# EAGLE design Grove - Differential Amplifier v1.1 (EAGLE 6.4)
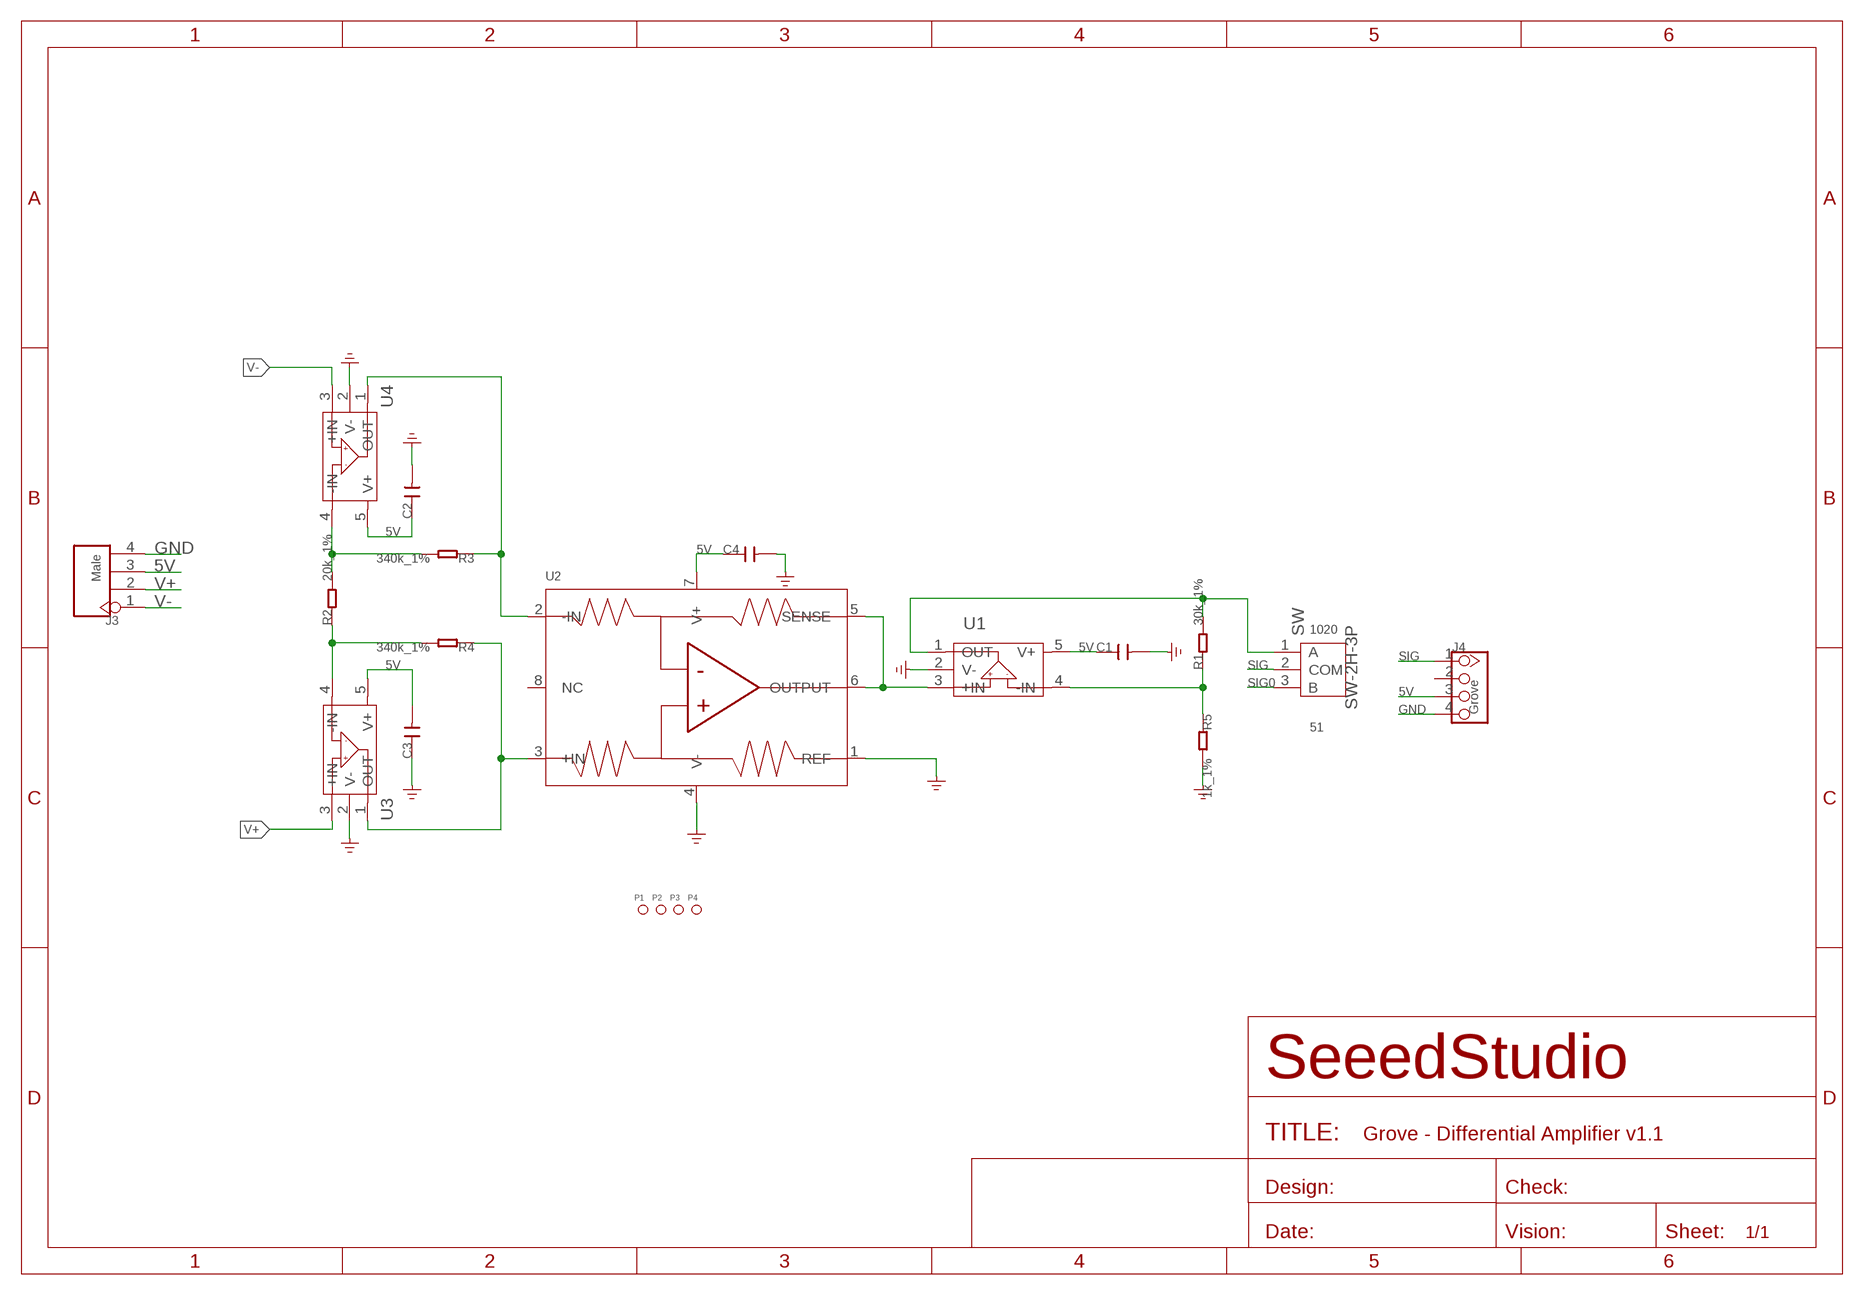
[diagram p0: schematic, sheet 1]

## Parts
C1  C-0603  [C0603]
C2  C-0603  [C0603]
C3  C-0603  [C0603]
C4  C-0603  [C0603]
J3  Male  HEADER-4P-60/35MIL  [4P-65/35MIL]
J4  Grove  TWIG-4P-2.0-2.0  [4P-2.0]
P1  PAD-MARK  [ROUND-MARK-1.0]
P2  PAD-MARK  [ROUND-MARK-1.0]
P3  PAD-MARK  [ROUND-MARK-1.0]
P4  PAD-MARK  [ROUND-MARK-1.0]
R1  30k_1%  R-0603  [R0603]
R2  20k_1%  R-0603  [R0603]
R3  340k_1%  R-0603  [R0603]
R4  340k_1%  R-0603  [R0603]
R5  1k_1%  R-0603  [R0603]
SW  SW-2H-3P  SWITCH-2H-3P'--'  [3P-2CH-3.54X8.5]
U1  OPA333DBV  [SOT23-5]
U2  INA132U/2K5  [SOIC8-6.0]
U3  OPA333DBV  [SOT23-5]
U4  OPA333DBV  [SOT23-5]

## Nets
5V: C1.1 C2.1 C3.2 C4.1 J3.3 J4.3 U1.5(V+) U2.7(V+) U3.5(V+) U4.5(V+)
GND: C1.2 C2.2 C3.1 C4.2 J3.4 J4.4 R5.2 U1.2(V-) U2.1(REF) U2.4(V-) U3.2(V-) U4.2(V-)
N$1: R1.1 R5.1 U1.4(-IN)
N$2: R1.2 SW.1(A) U1.1(OUT)
N$7: R2.1 R4.2 U3.4(-IN)
N$8: R2.2 R3.2 U4.4(-IN)
N$9: R3.1 U2.2(-IN) U4.1(OUT)
N$10: R4.1 U2.3(+IN) U3.1(OUT)
SIG: J4.1 SW.2(COM)
SIG0: SW.3(B) U1.3(+IN) U2.5(SENSE) U2.6(OUTPUT)
V+: J3.2 U3.3(+IN)
V-: J3.1 U4.3(+IN)
Unconnected: J4.2 U2.8(NC)

## Notes on the sheet
- 1020
- 51

## Library data of the parts
C1-C4 = Discrete:C*: Ceramic Capacitors
J3 = Connector:HEADER-4P
J4 = Connector:TWIG-4P-2.0
P1-P4 = Discrete:PAD-MARK; PARTNO: DNP
R1-R5 = Discrete:R*
SW = Discrete:SWITCH-2H-3P
U1 U3 U4 = IC:OPA333: 1.8V,Micro power CMOS oprational amplifiers Zero-Drift Series http://www.ti.com.cn/cn/lit/ds/symlink/opa333.pdf
U2 = template:INA132U/2K5: Low Power, Single-Supply DIFFERENCE AMPLIFIER

## Board
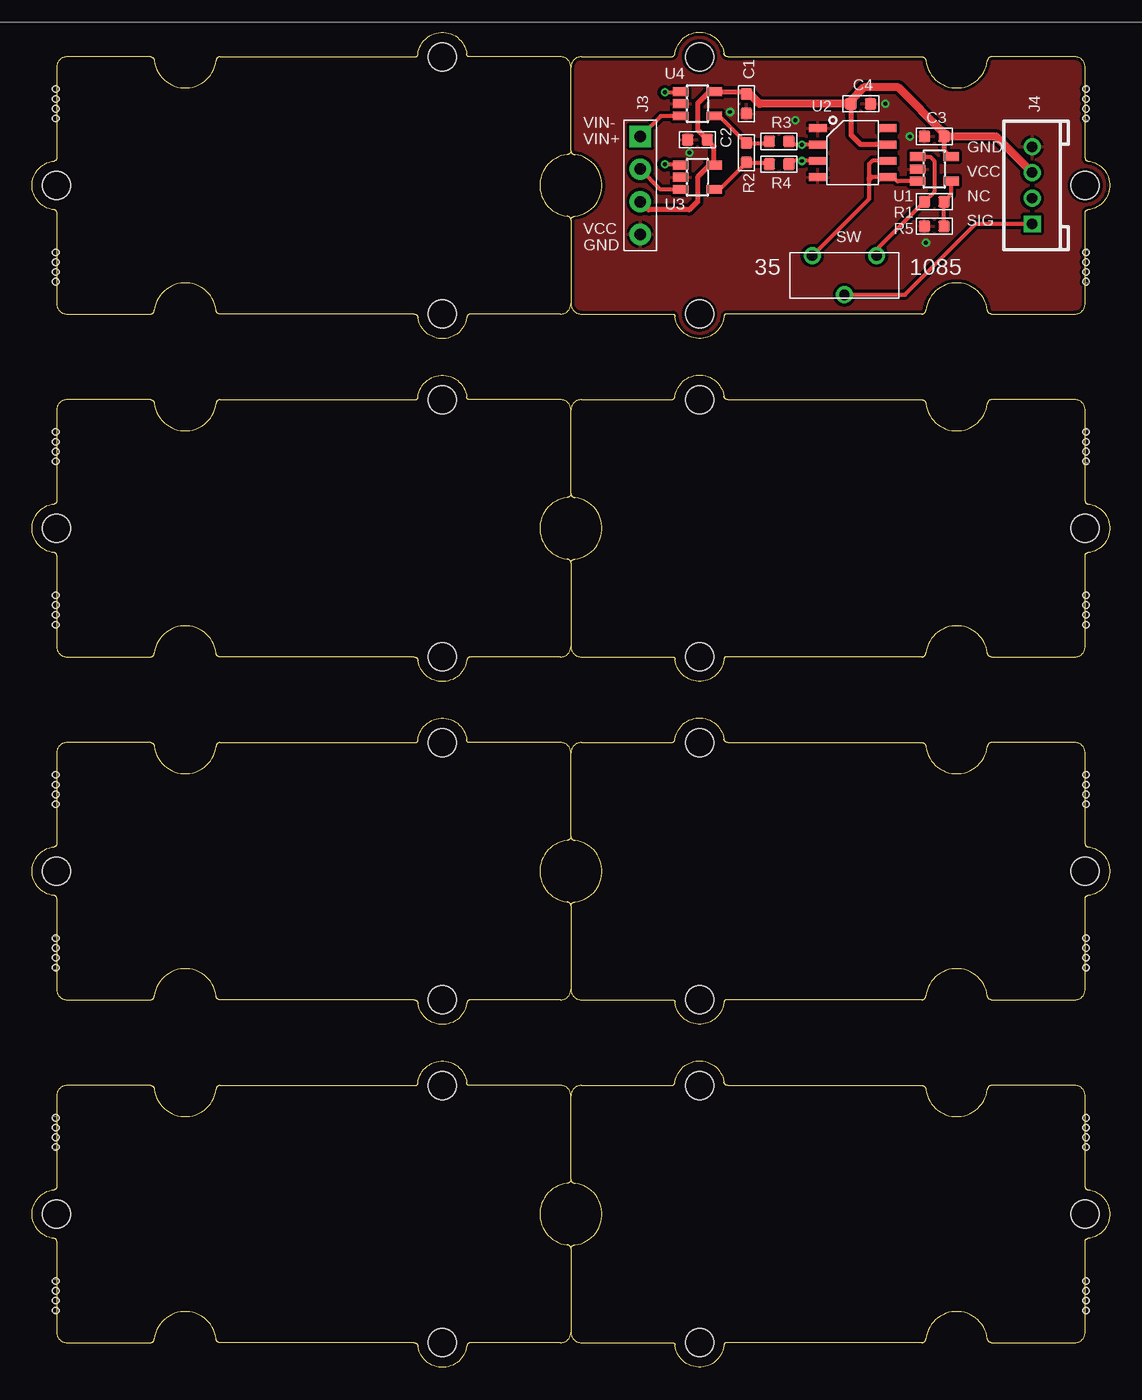
[diagram p1: board, top side]
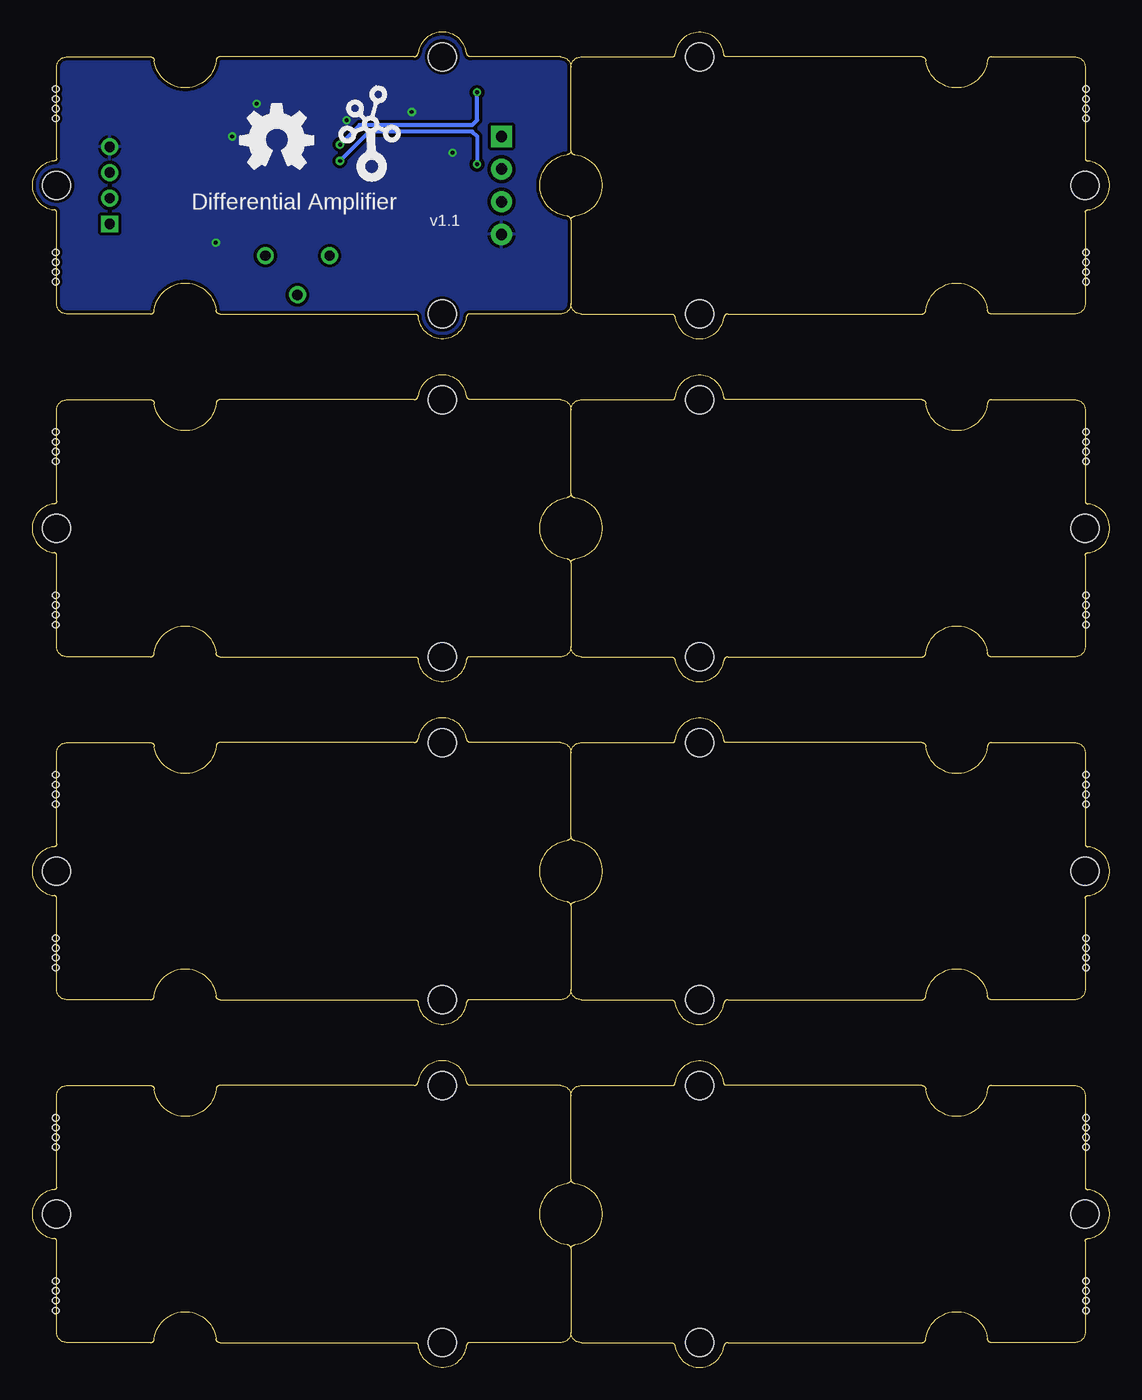
[diagram p2: board, bottom side, seen from below]

Size 83.82 x 103.85 mm. Coordinates in mm from the lower left corner, seen from the top.
Copper layers (1*16): Top 0.035mm / dielectric 1.5mm / Bottom 0.035mm
Design rules "SeeedStudio_DRU_no_angle_20130527 *": minimum track width 6mil, minimum drill 12mil, track to track 6mil, track to pad 6mil, pad to pad 6mil, via to via 6mil, smd to smd 0mil, copper to edge 10mil, drill to drill 10mil, minimum pad ring 10mil, minimum via ring 6mil, stop-mask expansion 2mil, vias tented up to drill 25mil, thermal gap 10mil
Holes 0.5 mm at 1.84,99.42 1.84,98.66 1.84,97.9 1.84,97.14 1.84,86.72 1.84,85.96 1.84,85.2 1.84,84.44 1.84,72.75 1.84,71.99 1.84,71.23 1.84,70.47 1.84,60.05 1.84,59.29 1.84,58.53 1.84,57.77 1.84,46.08 1.84,45.32 1.84,44.56 1.84,43.8 1.84,33.38 1.84,32.62 1.84,31.86 1.84,31.1 1.84,19.41 1.84,18.65 1.84,17.89 1.84,17.13 1.84,6.71 1.84,5.95 1.84,5.19 1.84,4.43 81.98,4.43 81.98,5.19 81.98,5.95 81.98,6.71 81.98,17.13 81.98,17.89 81.98,18.65 81.98,19.41 81.98,31.1 81.98,31.86 81.98,32.62 81.98,33.38 81.98,43.8 81.98,44.56 81.98,45.32 81.98,46.08 81.98,57.77 81.98,58.53 81.98,59.29 81.98,60.05 81.98,70.47 81.98,71.23 81.98,71.99 81.98,72.75 81.98,84.44 81.98,85.2 81.98,85.96 81.98,86.72 81.98,97.14 81.98,97.9 81.98,98.66 81.98,99.42
Holes 1.91 mm at -4.13,9.38 87.95,9.38 87.95,94.47 -4.13,94.47

### Footprints (pad centres in the part's own frame; a part is rotated, then mirrored left to right if it is on the bottom)
C0603 = smd 0.889 x 0.889: 1 -0.762,0; 2 0.762,0
4P-65/35MIL = drill 0.889 pad 1.651 square: 1 0,3.81 | drill 0.889 pad 1.651: 2 0,1.27; 3 0,-1.27; 4 0,-3.81
4P-2.0 = drill 0.8 pad 1.27 square: 1 -3,0 | drill 0.8 pad 1.27: 2 -1,0; 3 1,0; 4 3,0
ROUND-MARK-1.0 = smd 1.016 x 1.016: P$1 0,0
R0603 = smd 0.889 x 0.889: 1 -0.762,0; 2 0.762,0
3P-2CH-3.54X8.5 = drill 0.8 pad 1.3: 1 -2.5,-1.52; 2 0,1.52; 3 2.5,-1.52
SOT23-5 = smd 0.69 x 1.2: 1 -0.95,-1.3; 2 0,-1.3; 3 0.95,-1.3; 4 0.95,1.3; 5 -0.95,1.3
SOIC8-6.0 = smd 0.6 x 1.4: 1 -1.905,-2.7; 2 -0.635,-2.7; 3 0.635,-2.7; 4 1.905,-2.7; 5 1.905,2.7; 6 0.635,2.7; 7 -0.635,2.7; 8 -1.905,2.7
2U-DIM-W/DRILL = hole 2.2: -10,-10; -10,10; 20,0

### Placement (x,y rotation side)
C1  55.56,98.28 270 top
C2  51.75,95.49 180 top
C3  70.17,95.74 0 top
C4  64.45,98.28 0 top
J3  47.31,91.93 0 top
J4  77.79,91.93 90 top
P1  -4.13,4.3 0 top  (outside the outline)
P2  -4.13,99.55 0 top  (outside the outline)
P3  87.95,99.55 0 top  (outside the outline)
P4  87.95,4.3 0 top  (outside the outline)
R1  70.17,90.66 180 top
R2  55.56,94.47 90 top
R3  58.1,95.36 180 top
R4  58.1,93.58 180 top
R5  70.17,88.76 180 top
SW  63.18,84.95 180 top
U1  70.17,93.2 270 top
U2  63.82,94.47 270 top
U3  51.75,92.57 270 top
U4  51.75,98.28 270 top
U$12  [2U-DIM-W/DRILL]  61.91,91.93 0 top
U$13  [OSHW_FILLX200_NOTEXT]  67.63,93.2 0 bottom
U$14  [TWIGLOGO]  57.47,93.2 0 bottom
U$15  [2U-DIM-W/DRILL]  21.91,91.93 180 top
U$16  [2U-DIM-W/DRILL]  21.91,65.26 180 top
U$17  [2U-DIM-W/DRILL]  61.91,65.26 0 top
U$18  [2U-DIM-W/DRILL]  21.91,38.59 180 top
U$19  [2U-DIM-W/DRILL]  61.91,38.59 0 top
U$20  [2U-DIM-W/DRILL]  21.91,11.92 180 top
U$21  [2U-DIM-W/DRILL]  61.91,11.92 0 top

### Tracks (layer width: path | path; a pad name or v marks a point on that pad's centre or on a via)
5V
  Top 0.406: C3.2 70.93,94.69 U1.5 | 55.69,99.04 55.5,99.23 U4.5 52.7,99.23 51.75,98.28 51.75,96.25 C2.1 53.05,94.95 U3.5 52.7,93.52 51.75,92.57 51.75,90.66 51.12,90.03 47.94,90.03 J3.3 | U2.7 64.45,95.11 63.69,95.87 C4.1
  Top 0.61: J4.3 74.98,95.74 C3.2 70.93,96 67.37,99.55 64.71,99.55 63.56,98.41 C4.1 56.58,98.28 55.82,99.04 55.69,99.04 C1.1
GND  (via drill 0.3 pad 0.64)
  other vias: 69.53,87.49 51.12,94.47 66.36,98.28 68.26,95.74 54.29,97.65 59.37,97.01
  pour Bottom: 43.5,108.44 45.4,108.44 45.4,106.54 43.5,106.54
  pour Bottom (isolate 0.254): 41.59,79.87 84.14,79.87 84.14,104 41.59,104
  pour Top (isolate 0.254): 41.59,79.87 84.14,79.87 84.14,104 41.59,104
N$1
  Top 0.305: R5.1 R1.1 71.47,91.2 U1.4
N$2
  Top 0.305: U1.1 69.85,94.15 70.17,93.84 70.17,91.42 R1.2 65.68,86.94 SW.1
N$7
  Top 0.305: R4.2 57.21,93.71 R2.1 53.47,91.62 U3.4
N$8
  Top 0.305: R3.2 57.21,95.23 R2.2 53.47,97.33 U4.4
N$9  (via drill 0.3 pad 0.64)
  Top 0.305: R3.1 59.12,95.11 v59.88,95.11 U2.2 | v49.21,99.17 50.39,99.17 U4.1
  Bottom 0.305: v49.21,99.17 49.21,97.01 49.59,96.63 58.36,96.63 v59.88,95.11
N$10  (via drill 0.3 pad 0.64)
  Top 0.305: U2.3 v59.88,93.84 59.12,93.84 R4.1 | v49.21,93.58 50.39,93.58 U3.1
  Bottom 0.305: v49.21,93.58 49.21,95.74 49.59,96.12 57.6,96.12 v59.88,93.84
SIG
  Top 0.305: SW.2 67.89,83.43 73.09,88.63 73.34,88.88 73.39,88.93 J4.1
SIG0
  Top 0.305: U2.6 65.34,93.84 65.09,93.58 65.09,92.82 | 65.09,92.82 65.09,92.57 | 65.09,92.31 65.09,90.87 SW.3 | 65.34,92.57 U2.5 66.99,92.57 67.31,92.25 U1.3 | 65.34,92.57 65.09,92.57 | 65.09,92.82 65.34,92.57 | 65.34,92.57 65.09,92.31 | 65.09,92.31 65.09,92.57
V+
  Top 0.305: U3.3 48.89,91.62 J3.2
V-
  Top 0.305: U4.3 48.9,97.33 J3.1

### Text on the board
tPlace: VIN- | VIN+ | GND | VCC | NC | SIG | VCC | GND
bPlace: Differential Amplifier | v1.1
tNames: 35 | 1085